# Altium schematic sheet USB_To_UART.SchDoc
size A; SheetNumber: 3; SheetTotal: 5
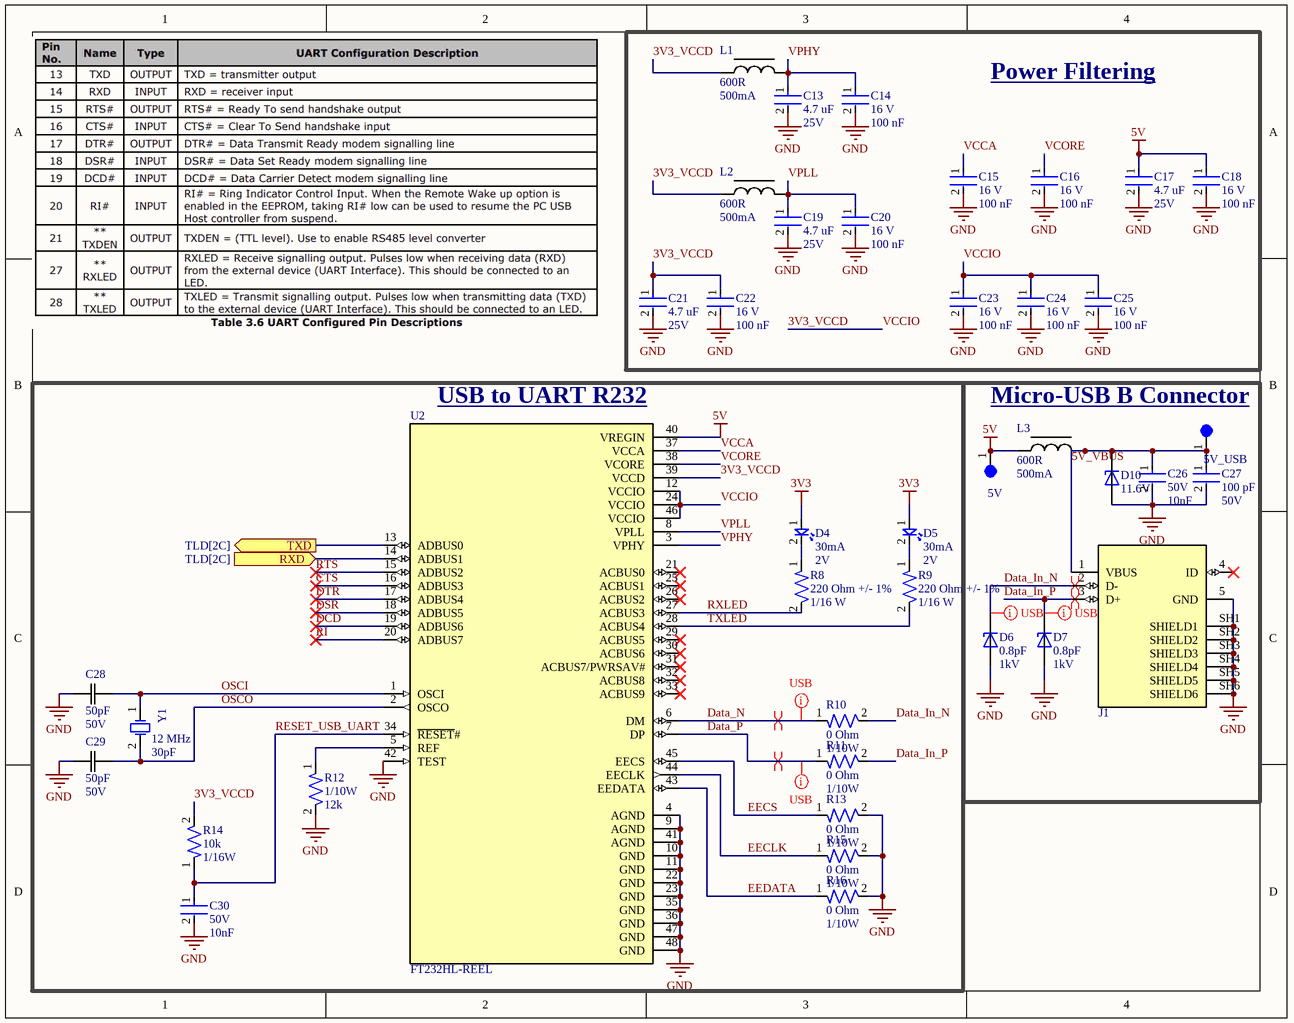
[diagram p0: USB_To_UART.SchDoc]

## Parts
5V  5003  [TEST-POINT-0001]  (value not drawn)
5V_USB  5003  [TEST-POINT-0001]  (value not drawn)
C13  Capacitance: 4.7 uF  Voltage: 25V  [CAP-0603]  (hidden comment: CC0603KRX5R8BB475)
C14  Voltage Rating: 16 V  Capacitance: 100 nF  [CAP-0402]  (hidden comment: CC0402KRX7R7BB104)
C15  Voltage Rating: 16 V  Capacitance: 100 nF  [CAP-0402]  (hidden comment: CC0402KRX7R7BB104)
C16  Voltage Rating: 16 V  Capacitance: 100 nF  [CAP-0402]  (hidden comment: CC0402KRX7R7BB104)
C17  Capacitance: 4.7 uF  Voltage: 25V  [CAP-0603]  (hidden comment: CC0603KRX5R8BB475)
C18  Voltage Rating: 16 V  Capacitance: 100 nF  [CAP-0402]  (hidden comment: CC0402KRX7R7BB104)
C19  Capacitance: 4.7 uF  Voltage: 25V  [CAP-0603]  (hidden comment: CC0603KRX5R8BB475)
C20  Voltage Rating: 16 V  Capacitance: 100 nF  [CAP-0402]  (hidden comment: CC0402KRX7R7BB104)
C21  Capacitance: 4.7 uF  Voltage: 25V  [CAP-0603]  (hidden comment: CC0603KRX5R8BB475)
C22  Voltage Rating: 16 V  Capacitance: 100 nF  [CAP-0402]  (hidden comment: CC0402KRX7R7BB104)
C23  Voltage Rating: 16 V  Capacitance: 100 nF  [CAP-0402]  (hidden comment: CC0402KRX7R7BB104)
C24  Voltage Rating: 16 V  Capacitance: 100 nF  [CAP-0402]  (hidden comment: CC0402KRX7R7BB104)
C25  Voltage Rating: 16 V  Capacitance: 100 nF  [CAP-0402]  (hidden comment: CC0402KRX7R7BB104)
C26  Voltage: 50V  Capacitance: 10nF  [CAP-0805]  (hidden comment: GRM2195C1H103JA01D)
C27  Capacitance: 100 pF  Voltage: 50V  [CAP-0402]  (hidden comment: CC0402JRNPO9BN101)
C28  Capacitance: 50pF  Voltage: 50V  [CAP_CC0402_YAG]  (hidden comment: CC0402JRNPO9BN500)
C29  Capacitance: 50pF  Voltage: 50V  [CAP_CC0402_YAG]  (hidden comment: CC0402JRNPO9BN500)
C30  Voltage: 50V  Capacitance: 10nF  [CAP-0805]  (hidden comment: GRM2195C1H103JA01D)
D4  Forward Current: 30mA  Forward Voltage: 2V  [LED-0603]  (hidden comment: BL-HKC36G-AV-TRB)
D5  Forward Current: 30mA  Forward Voltage: 2V  [LED-0603]  (hidden comment: BL-HKC36G-AV-TRB)
D6  Capacitance: 0.8pF  Voltage: 1kV  [TVS_ESD321DPYR]  (hidden comment: ESD321DPYR)
D7  Capacitance: 0.8pF  Voltage: 1kV  [TVS_ESD321DPYR]  (hidden comment: ESD321DPYR)
D10  Voltage: 11.6V  [TVS_ESDA7P60-1U1M]  (hidden comment: ESDA7P60-1U1M)
J1  1050170001  [MOLEX_1050170001]  (value not drawn)
L1  Resistance: 600R  Current: 500mA  [FILTER_BLM18AG_MUR-L]  (hidden comment: BLM18AG601SN1D)
L2  Resistance: 600R  Current: 500mA  [FILTER_BLM18AG_MUR-L]  (hidden comment: BLM18AG601SN1D)
L3  Resistance: 600R  Current: 500mA  [FILTER_BLM18AG_MUR-L]  (hidden comment: BLM18AG601SN1D)
R8  Resistance: 220 Ohm +/- 1%  Power: 1/16 W  [RES-0402]  (hidden comment: RM04FTN2200)
R9  Resistance: 220 Ohm +/- 1%  Power: 1/16 W  [RES-0402]  (hidden comment: RM04FTN2200)
R10  Resistance: 0 Ohm  Power: 1/10W  [RESC1607X60N]  (hidden comment: RESC1607X60N)
R11  Resistance: 0 Ohm  Power: 1/10W  [RESC1607X60N]  (hidden comment: RESC1607X60N)
R12  Power: 1/10W  Resistance: 12k  [RES-0603]  (hidden comment: RC0603FR-0712KL)
R13  Resistance: 0 Ohm  Power: 1/10W  [RESC1607X60N]  (hidden comment: RESC1607X60N)
R14  Resistance: 10k  Power: 1/16W  [RES-0402]  (hidden comment: RC0402FR-0710KL)
R15  Resistance: 0 Ohm  Power: 1/10W  [RESC1607X60N]  (hidden comment: RESC1607X60N)
R16  Resistance: 0 Ohm  Power: 1/10W  [RESC1607X60N]  (hidden comment: RESC1607X60N)
U2  FT232HL-REEL  [QFP50P900X900X160-48N]
Y1  Frequency: 12 MHz  Load Capacitance: 30pF  [WE-XTAL_HC49/4HSMX]  (hidden comment: 830010043)

## Blocks framed on the sheet
Power Filtering: C13-C25 L1 L2
USB to UART R232: C28-C30 D4 D5 R8-R16 U2 Y1
Micro-USB B Connector: 5V 5V_USB C26 C27 D6 D7 D10 J1 L3

## Ports
RXD (in, see TLD[2C]), TXD (out, see TLD[2C])

## Nets
3V3: D4.1 D5.1
5V: 5V.1 C17.1 C18.1 L3.1 U2.40(VREGIN)
GND: C13.2 C14.2 C15.2 C16.2 C17.2 C18.2 C19.2 C20.2 C21.2 C22.2 C23.2 C24.2 C25.2 C26.2 C27.2 C28.1 C29.1 C30.2 D6.2 D7.2 D10.2 J1.5(GND) J1.SH1(SHIELD1) J1.SH2(SHIELD2) J1.SH3(SHIELD3) J1.SH4(SHIELD4) J1.SH5(SHIELD5) J1.SH6(SHIELD6) R12.2 R13.2 R15.2 R16.2 U2.4(AGND) U2.9(AGND) U2.10(GND) U2.11(GND) U2.22(GND) U2.23(GND) U2.35(GND) U2.36(GND) U2.41(AGND) U2.42(TEST) U2.47(GND) U2.48(GND)
3V3_VCCD: C21.1 C22.1 C23.1 C24.1 C25.1 L1.1 L2.1 R14.2 U2.12(VCCIO) U2.24(VCCIO) U2.39(VCCD) U2.46(VCCIO)  [also labelled VCCIO]
5V_VBUS: 5V_USB.1 C26.1 C27.1 D10.1 J1.1(VBUS) L3.2
CTS: U2.16(ADBUS3)
Data_In_N: D6.1 J1.2(D-) R10.2
Data_In_P: D7.1 J1.3(D+) R11.2
Data_N: R10.1 U2.6(DM)
Data_P: R11.1 U2.7(DP)
DCD: U2.19(ADBUS6)
DSR: U2.18(ADBUS5)
DTR: U2.17(ADBUS4)
EECLK: R15.1 U2.44(EECLK)
EECS: R13.1 U2.45(EECS)
EEDATA: R16.1 U2.43(EEDATA)
OSCI: C28.2 U2.1(OSCI) Y1.1(OSC1)
OSCO: C29.2 U2.2(OSCO) Y1.2(OSC2)
RESET_USB_UART: C30.1 R14.1 U2.34(~{RESET}#)
RI: U2.20(ADBUS7)
RTS: U2.15(ADBUS2)
RXD: U2.14(ADBUS1) ; port RXD
RXLED: R8.2 U2.27(ACBUS3)
TXD: U2.13(ADBUS0) ; port TXD
TXLED: R9.2 U2.28(ACBUS4)
VCCA: C15.1 U2.37(VCCA)
VCORE: C16.1 U2.38(VCORE)
VPHY: C13.1 C14.1 L1.2 U2.3(VPHY)
VPLL: C19.1 C20.1 L2.2 U2.8(VPLL)
NetD4_2: D4.2 R8.1
NetD5_2: D5.2 R9.1
NetR12_1: R12.1 U2.5(REF)

Not connected (* = marked no-connect by the designer): J1 4(ID)*; U2 21(ACBUS0)* 25(ACBUS1)* 26(ACBUS2)* 29(ACBUS5)* 30(ACBUS6)* 31(ACBUS7/PWRSAV#)* 32(ACBUS8)* 33(ACBUS9)*

## Layout directives
differential pair; differential pair class USB: Data_In_N, Data_In_P, Data_N, Data_P
mark named USB: Data_In_N, Data_In_P, Data_N, Data_P

## Library data of the parts
5V 5V_USB = TEST-POINT-0001: Oranange PC Test Point, Miniature Phoisphor Bronze Silver Plating Through Hole Mounting Type
C13 C17 C19 C21 = CAP-4.7U-0001: CAP CER 4.7UF 25V X5R 0603; Device Class: Ceramic; Size: 0603
C14-C16 C18 C20 C22-C25 = CAP-0.1U-0001: CAP CER 0.1UF 16V X7R 0402; ComponentLink2Description: Datasheet; ComponentLink2URL: https://www.yageo.com/upload/media/product/productsearch/datasheet/mlcc/UPY-GPHC_X7R_6.3V-to-250V_24.pdf; Device Class: Ceramic; Size: 0402
C26 C30 = CAP-10N-0001: CAP CER 10000PF 50V C0G/NP0 0805; Device Class: Ceramic; Size: 0805; ComponentLink1Description: Datasheet; ComponentLink1URL: https://search.murata.co.jp/Ceramy/image/img/A01X/G101/ENG/GRM2195C1H103JA01-01.pdf
C27 = CAP-100P-0001: CAP CER 100PF 50V C0G/NPO 0402; Device Class: Ceramic; Size: 0402; ComponentLink1Description: Datasheet; ComponentLink1URL: https://www.yageo.com/upload/media/product/productsearch/datasheet/mlcc/UPY-GP_NP0_16V-to-50V_18.pdf
C28 C29 = CAP-50p: 50 pF ±5% 50V Ceramic Capacitor C0G, NP0 0402 (1005 Metric); Manufacturer_Name: Yageo; Copyright: Copyright (C) 2025 Ultra Librarian. All rights reserved.; Manufacturer_Part_Number: CC0402JRNPO9BN500; ComponentLink1Description: Datasheet; ComponentLink1URL: https://www.yageo.com/en/Chart/Download/pdf/CC0402JRNPO9BN500
D4 D5 = LED-0001: LED YELLOW CLEAR 0603 SMD; ComponentLink1Description: Datasheet; ComponentLink1URL: https://www.americanbrightled.com/pdffiles/led-components/smt/BL-HKC36G-AV-TRB.pdf
D6 D7 = DIO-TVS-0004: 0.8-pF 3.3-V Â±30-kV ESD protection diode with 6.8-V 16-A TLP clamping in 0402 package for USB 2.0; MF: Texas Instruments; SnapEDA_Link: https://www.snapeda.com/parts/ESD321DPYR/Texas+Instruments/view-part/?ref=snap; Package: X1SON-2 Texas Instruments; Value: *; MP: ESD321DPYR; Check_prices: https://www.snapeda.com/parts/ESD321DPYR/Texas+Instruments/view-part/?ref=eda; ComponentLink1Description: Datasheet; ComponentLink1URL: https://www.ti.com/general/docs/suppproductinfo.tsp?distId=10&gotoUrl=https%3A%2F%2Fwww.ti.com%2Flit%2Fgpn%2Fesd321
D10 = DIO-TVS-11V: TVS DIODE 5VWM 11.6VC 1610; MF: {'manufacturer': u'STMicroelectronics'}; Package: None; Price: None; Value: *; MP: ESDA7P60-1U1M; Availability: Unavailable; ComponentLink1Description: Datasheet; ComponentLink1URL: https://www.st.com/resource/en/datasheet/esda20p50-1u1m.pdf
J1 = CONN-Micro-USB-B-0001: USB - micro B USB 2.0 Receptacle Connector 5 Position Surface Mount, Right Angle; Through Hole; MF: Molex; SnapEDA_Link: https://www.snapeda.com/parts/1050170001/Molex/view-part/?ref=snap; Package: None; Value: *; MP: 1050170001; Check_prices: https://www.snapeda.com/parts/1050170001/Molex/view-part/?ref=eda; ComponentLink1Description: Datasheet; ComponentLink1URL: https://www.molex.com/pdm_docs/sd/1050170001_sd.pdf
L1-L3 = FBEAD-600R-0.5A: 600 Ohms @ 100 MHz 1 Ferrite Bead 0603 (1608 Metric) 500mA 380mOhm; Manufacturer_Name: Murata; Copyright: Copyright (C) 2025 Ultra Librarian. All rights reserved.; Manufacturer_Part_Number: BLM18AG601SN1D; ComponentLink1Description: Datasheet; ComponentLink1URL: https://www.murata.com/en-us/products/productdata/8796738650142/ENFA0003.pdf
R8 R9 = RES-220-0002-JLC: 62.5mW Thick Film Resistors 50V ±100ppm/℃ ±1% -55℃~+155℃ 220Ω 0402  Chip Resistor - Surface Mount ROHS; assembled?: yes; JLC part number: C160487
R10 R11 R13 R15 R16 = RES-0-0003: 0 Ohms Jumper Chip Resistor 0603 (1608 Metric) Moisture Resistant Thick Film; assembled?: yes; JLC part number: C106231
R12 = RES-12k-0001: RES 12K OHM 1% 1/10W 0603; Tolerance: 1%; Size: 0603; ComponentLink1Description: Datasheet; ComponentLink1URL: https://www.lcsc.com/datasheet/lcsc_datasheet_2304140030_YAGEO-RC0603FR-0712KL_C114659.pdf
R14 = RES-10k-0001: RES 10K OHM 1% 1/16W 0402; Tolerance: 1%; Size: 0402; ComponentLink1Description: Datasheet; ComponentLink1URL: https://www.yageo.com/upload/media/product/products/datasheet/rchip/PYu-RC_Group_51_RoHS_L_12.pdf
U2 = IC-USB-TO_UART: Ic, Interface; Usb Hi-Speed To Uart/Fifo/Spi/Jtag, I2c; 1.8v-5.25v; 25ma; Lqfp-48; MF: FTDI, Future; Package: LQFP-48 FTDI; Price: None; Check_prices: https://www.snapeda.com/parts/FT232HL-REEL/FTDI%252C+Future+Technology+Devices+International+Ltd/view-part/?ref=eda; Value: *; SnapEDA_Link: https://www.snapeda.com/parts/FT232HL-REEL/FTDI%252C+Future+Technology+Devices+International+Ltd/view-part/?ref=snap; MP: FT232HL-REEL; Availability: In Stock; Purchase-URL: https://pricing.snapeda.com/search/part/FT232HL-REEL/?ref=eda; ComponentLink1Description: Datasheet; ComponentLink1URL: https://ftdichip.com/wp-content/uploads/2023/09/DS_FT232H.pdf
Y1 = CRYSTAL-12MHz-30pF: WE-XTAL Quartz Crystal, SMT, HC49/4HSMX, 12 MHz, ±30ppm; Manufacturer: Wurth Elektronik; Frequency Stability: 50ppm; Manufacturer Part Number: 830010043; Category: Crystals; Match Code: WE-XTAL; ComponentLink1Description: Website Link; ComponentLink1URL: https://www.we-online.com/redexpert/article/830010043?ad; ComponentLink2Description: Datasheet Link; ComponentLink2URL: https://www.we-online.com/redexpert/spec/830010043?ad; Mount: Surface Mount; Min Operating Temperature: -10°C; Max Operating Temperature: 60°C; Packaging: Tape and Reel; Case/Size Code: HC49/4HSMX; Length: 12.4mm; Width: 4.7mm; Height: 4.5mm; Application: Processor, USB, CAN; Frequency Tolerance: ±30ppm